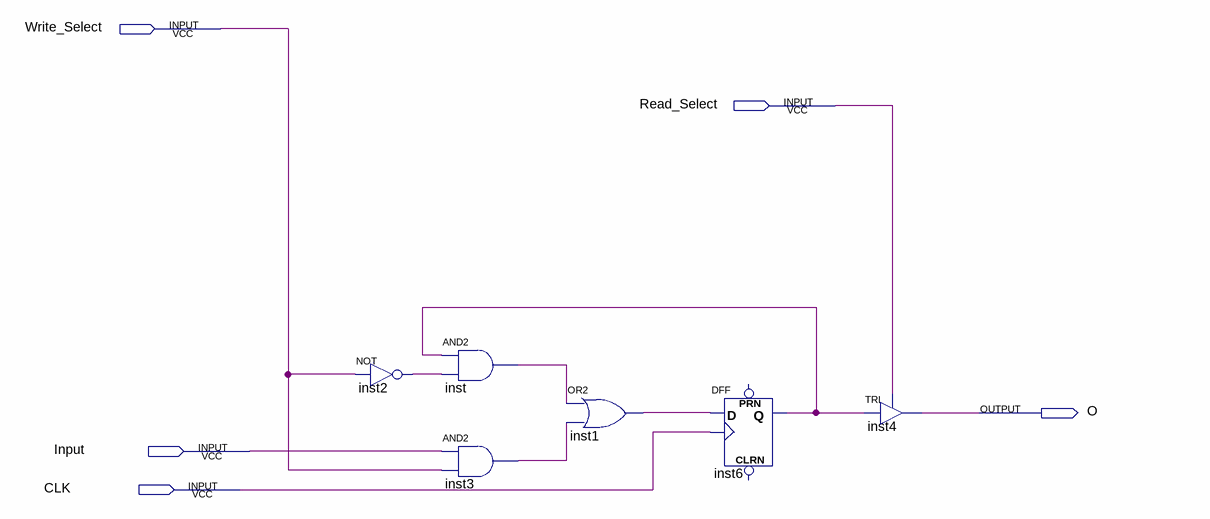
[diagram p0: schematic sheet]
// Quartus schematic RFC.bdf as structural Verilog: 6 symbols, 5 pins
module RFC (
  input  Write_Select,
  input  Read_Select,
  input  Input,
  input  CLK,
  output O
);

  wire inst1_out, inst2_out, inst3_out, inst6_q, inst_out;

  not inst2 (inst2_out, Write_Select);
  and inst (inst_out, inst6_q, inst2_out);
  and inst3 (inst3_out, Input, Write_Select);
  or inst1 (inst1_out, inst_out, inst3_out);
  DFF inst6 (.CLK(CLK), .D(inst1_out), .Q(inst6_q));  // open: CLRN, PRN
  TRI inst4 (.IN(inst6_q), .OE(Read_Select), .OUT(O));
endmodule
